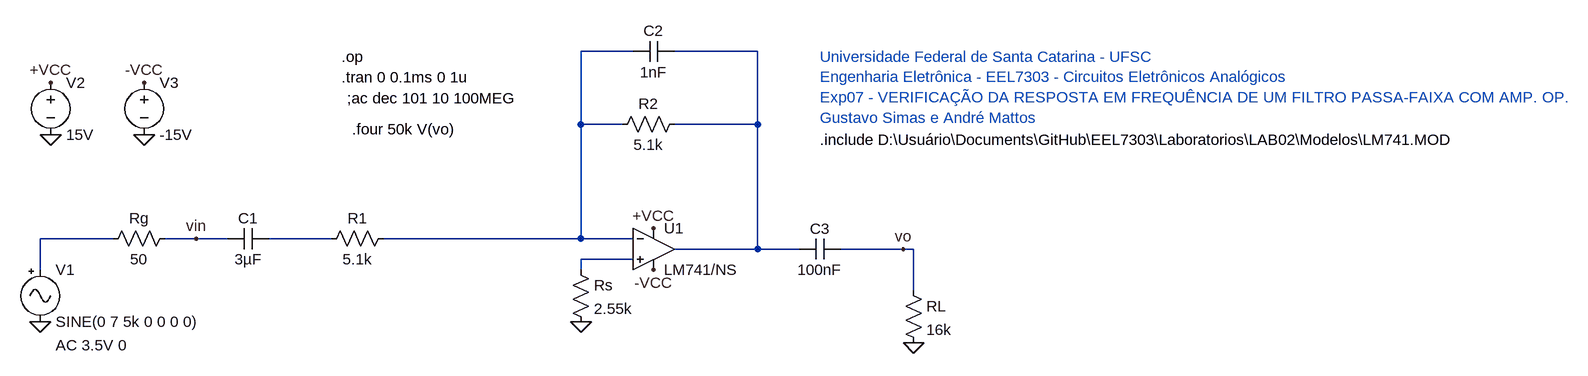
[diagram p0: schematic Lab07.asc]
Lab07.asc, the LTspice schematic file:
Version 4
SHEET 1 2440 680
WIRE 1008 -240 928 -240
WIRE 1200 -240 1072 -240
WIRE 928 -128 928 -240
WIRE 992 -128 928 -128
WIRE 1200 -128 1200 -240
WIRE 1200 -128 1072 -128
WIRE 208 48 96 48
WIRE 336 48 288 48
WIRE 384 48 336 48
WIRE 544 48 448 48
WIRE 928 48 928 -128
WIRE 928 48 624 48
WIRE 1008 48 928 48
WIRE 1200 64 1200 -128
WIRE 1200 64 1072 64
WIRE 1264 64 1200 64
WIRE 1424 64 1328 64
WIRE 1440 64 1424 64
WIRE 1008 80 928 80
WIRE 96 96 96 48
WIRE 928 96 928 80
WIRE 1440 128 1440 64
FLAG 96 176 0
FLAG 928 176 0
FLAG 1440 208 0
FLAG 112 -112 0
FLAG 256 -112 0
FLAG 112 -192 +VCC
FLAG 256 -192 -VCC
FLAG 1040 32 +VCC
FLAG 1040 96 -VCC
FLAG 336 48 vin
FLAG 1424 64 vo
SYMBOL Misc\\signal 96 80 R0
WINDOW 123 24 132 Left 2
WINDOW 39 0 0 Left 0
SYMATTR InstName V1
SYMATTR Value SINE(0 7 5k 0 0 0 0)
SYMATTR Value2 AC 3.5V 0
SYMBOL res 304 32 R90
WINDOW 0 0 56 VBottom 2
WINDOW 3 32 56 VTop 2
SYMATTR InstName Rg
SYMATTR Value 50
SYMBOL cap 448 32 R90
WINDOW 0 0 32 VBottom 2
WINDOW 3 32 32 VTop 2
SYMATTR InstName C1
SYMATTR Value 3µF
SYMBOL res 640 32 R90
WINDOW 0 0 56 VBottom 2
WINDOW 3 32 56 VTop 2
SYMATTR InstName R1
SYMATTR Value 5.1k
SYMBOL res 1088 -144 R90
WINDOW 0 0 56 VBottom 2
WINDOW 3 32 56 VTop 2
SYMATTR InstName R2
SYMATTR Value 5.1k
SYMBOL cap 1072 -256 R90
WINDOW 0 0 32 VBottom 2
WINDOW 3 32 32 VTop 2
SYMATTR InstName C2
SYMATTR Value 1nF
SYMBOL cap 1328 48 R90
WINDOW 0 0 32 VBottom 2
WINDOW 3 32 32 VTop 2
SYMATTR InstName C3
SYMATTR Value 100nF
SYMBOL res 912 80 R0
SYMATTR InstName Rs
SYMATTR Value 2.55k
SYMBOL Opamps\\opamp2 1040 0 R0
SYMATTR InstName U1
SYMATTR Value LM741/NS
SYMBOL res 1424 112 R0
SYMATTR InstName RL
SYMATTR Value 16k
SYMBOL voltage 112 -208 R0
WINDOW 123 0 0 Left 0
WINDOW 39 0 0 Left 0
SYMATTR InstName V2
SYMATTR Value 15V
SYMBOL voltage 256 -208 R0
WINDOW 123 0 0 Left 0
WINDOW 39 0 0 Left 0
SYMATTR InstName V3
SYMATTR Value -15V
TEXT 560 -232 Left 2 !.op
TEXT 560 -200 Left 2 !.tran 0 0.1ms 0 1u
TEXT 1296 -232 Left 2 ;Universidade Federal de Santa Catarina - UFSC\nEngenharia Eletrônica - EEL7303 - Circuitos Eletrônicos Analógicos\nExp07 - VERIFICAÇÃO DA RESPOSTA EM FREQUÊNCIA DE UM FILTRO PASSA-FAIXA COM AMP. OP.\nGustavo Simas e André Mattos
TEXT 1296 -104 Left 2 !.include D:\\Usuário\\Documents\\GitHub\\EEL7303\\Laboratorios\\LAB02\\Modelos\\LM741.MOD
TEXT 568 -168 Left 2 !;ac dec 101 10 100MEG
TEXT 576 -120 Left 2 !.four 50k V(vo)

The netlist it stands for:
* Lab07.asc
V1 N003 0 SINE(0 7 5k 0 0 0 0) AC 3.5V 0
Rg vin N003 50
C1 N004 vin 3µF
R1 N001 N004 5.1k
R2 N002 N001 5.1k
C2 N002 N001 1nF
C3 vo N002 100nF
Rs N005 0 2.55k
XU1 N005 N001 +VCC -VCC N002 LM741/NS  ; pins In+ In- V+ V- OUT
RL vo 0 16k
V2 +VCC 0 15V
V3 -VCC 0 -15V
.op
.tran 0 0.1ms 0 1u
* Universidade Federal de Santa Catarina - UFSC
* Engenharia Eletrônica - EEL7303 - Circuitos Eletrônicos Analógicos
* Exp07 - VERIFICAÇÃO DA RESPOSTA EM FREQUÊNCIA DE UM FILTRO PASSA-FAIXA COM AMP. OP.
* Gustavo Simas e André Mattos
.include D:\Usuário\Documents\GitHub\EEL7303\Laboratorios\LAB02\Modelos\LM741.MOD
;ac dec 101 10 100MEG
.four 50k V(vo)
.backanno
.end